# Altium schematic sheet Sheet1(final).SchDoc: ESP8266 Wifi Module
size A4
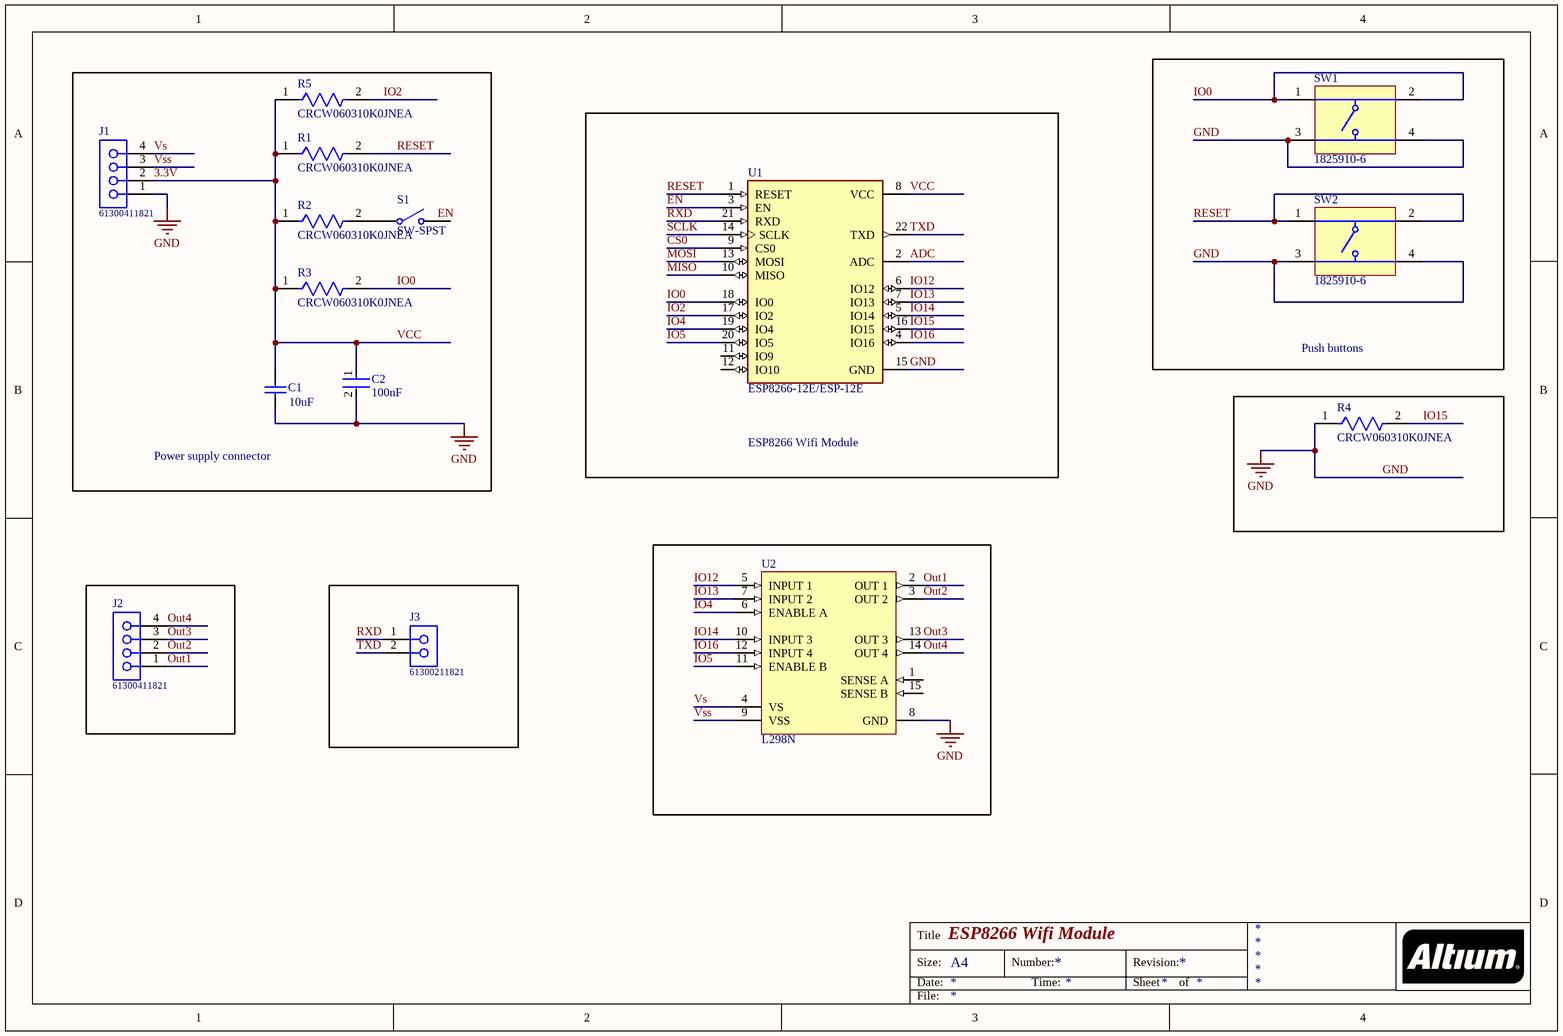
[diagram p0: Sheet1(final).SchDoc]

## Parts
C1  10uF  [CAPC2013X95X45ML10T25]
C2  100nF  [FP-CL43-IPC_B]
J1  61300411821  [61300411821]
J2  61300411821  [61300411821]
J3  61300211821  [61300211821]
R1  CRCW060310K0JNEA  [FP-CRCW0603-e3-MFG]
R2  CRCW060310K0JNEA  [FP-CRCW0603-e3-MFG]
R3  CRCW060310K0JNEA  [FP-CRCW0603-e3-MFG]
R4  CRCW060310K0JNEA  [FP-CRCW0603-e3-MFG]
R5  CRCW060310K0JNEA  [FP-CRCW0603-e3-MFG]
S1  SW-SPST  [SPST-2]
SW1  1825910-6  [TECO-1825910-6_V]
SW2  1825910-6  [TECO-1825910-6_V]
U1  ESP8266-12E/ESP-12E  [XCVR_ESP8266-12E/ESP-12E]
U2  L298N  [STM-FM-15]

## Blocks framed on the sheet
Power supply connector: C1 C2 J1 R1-R3 R5 S1
Push buttons: SW1 SW2
ESP8266 Wifi Module: U1

## Nets
GND: C1.1 C2.2 J1.1 R4.1 SW1.3 SW1.4 SW2.3 SW2.4 U1.15(GND) U2.8(GND)
3.3V: C1.2 C2.1 J1.2 R1.1 R2.1 R3.1 R5.1 U1.8(VCC)  [also labelled VCC]
ADC: U1.2(ADC)
CS0: U1.9(CS0)
EN: U1.3(EN)
IO0: R3.2 SW1.1 SW1.2 U1.18(IO0)
IO2: R5.2 U1.17(IO2)
IO4: U1.19(IO4) U2.6(ENABLE_A)
IO5: U1.20(IO5) U2.11(ENABLE_B)
IO12: U1.6(IO12) U2.5(INPUT_1)
IO13: U1.7(IO13) U2.7(INPUT_2)
IO14: U1.5(IO14) U2.10(INPUT_3)
IO15: R4.2 U1.16(IO15)
IO16: U1.4(IO16) U2.12(INPUT_4)
MISO: U1.10(MISO)
MOSI: U1.13(MOSI)
Out1: J2.1 U2.2(OUT_1)
Out2: J2.2 U2.3(OUT_2)
Out3: J2.3 U2.13(OUT_3)
Out4: J2.4 U2.14(OUT_4)
RESET: R1.2 SW2.1 SW2.2 U1.1(RESET)
RXD: J3.1 U1.21(RXD)
SCLK: U1.14(SCLK)
TXD: J3.2 U1.22(TXD)
Vs: J1.4 U2.4(VS)
Vss: J1.3 U2.9(VSS)
NetR2_2: R2.2 S1.1(COMMON)

Not connected (* = marked no-connect by the designer): S1 2(NO); U1 11(IO9) 12(IO10); U2 1(SENSE_A) 15(SENSE_B)

## Notes on the sheet
- Labels drawn without touching a wire or pin: EN
- Title
- Size:
- Date:
- A4
- Number:
- Time:
- Revision:
- Sheet
- of
- File:

## Library data of the parts
C1 = CMP-2007-00182-1: Manufacturer: Murata; Part Number: GRM219R61E106KA12D
C2 = CMP-13271-000927-1: Cap Ceramic 100nF 500V X7R ±10% SMD 1812 +125°C Embossed T/R; Mount: Surface Mount; Capacitance: 100nF; Voltage: 500V; Voltage Rating (DC): 500V; Voltage Rating: 500V; Length: 4.5mm; Height: 2mm; Case/Package: 1812; Radiation Hardening: No; Thickness: 0.087inch; Packaging: Tape and Reel; Package Quantity: 4000; Tolerance: 10%; Dielectric: X7R; Max Operating Temperature: 125°C; Width: 0.126inch; Min Operating Temperature: -55°C; Depth: 3.2mm
J1 J2 = 61300411821: WR-PHD Socket Header, THT, pitch 2.54mm, Single Row, Vertical, 4p; Manufacturer: Wurth Elektronik; Pin Number: 4; Rated Current: 3A; Working Voltage: 250VAC; Withstanding Voltage: 500VAC; Contact Resistance: 20mOhm; ComponentLink1Description: Manufacturer; ComponentLink1URL: http://www.we-online.de; ComponentLink2Description: Datasheet; ComponentLink2URL: https://www.we-online.com/catalog/datasheet/61300411821.pdf; Manufacturer Part Number: 61300411821; Published Date: May 2020; Pitch: 2.54mm; Operating Temperature: -40 to +125degC; Mounting Technology: THT; Packaging: Tray; Gender: Socket Header; Row Number: Single; Orientation: Vertical
J3 = 61300211821: WR-PHD Socket Header, THT, pitch 2.54mm, Single Row, Vertical, 2p; Manufacturer: Wurth Elektronik; Pin Number: 2; Rated Current: 3A; Working Voltage: 250VAC; Withstanding Voltage: 500VAC; Contact Resistance: 20mOhm; ComponentLink1Description: Manufacturer; ComponentLink1URL: http://www.we-online.de; ComponentLink2Description: Datasheet; ComponentLink2URL: https://www.we-online.com/catalog/datasheet/61300211821.pdf; Manufacturer Part Number: 61300211821; Published Date: May 2020; Pitch: 2.54mm; Operating Temperature: -40 to +125degC; Mounting Technology: THT; Packaging: Tray; Gender: Socket Header; Row Number: Single; Orientation: Vertical
R1-R5 = CMP-2000-03838-2: RES Thick Film, 10kΩ, 5%, 0.1W, 200ppm/°C, 0603; Max Power Dissipation: 100mW; Voltage Rating: 75V; Resistance: 10kR; Termination: SMD/SMT; Depth: 0.85mm; Weight: 7.1E-05oz; Military Standard: Not; Case Code (Imperial): 0603; Lead Free: Lead Free; Features: Automotive AEC-Q200; Tolerance: 5%; Case Code (Metric): 1608; Package Quantity: 1; Radiation Hardening: No; Number of Terminations: 2; Max Operating Temperature: 155°C; Min Operating Temperature: -55°C; Composition: Thick Film; Number of Pins: 2; Height: 0.02inch; Contact Plating: Tin; Temperature Coefficient: 200ppm/°C; Width: 0.033inch; Packaging: Tape and Reel; Length: 1.55mm; Mount: Surface Mount; Voltage Rating (DC): 75V; Case/Package: 0603; Power Rating: 100mW
S1 = SW-SPST: Single-Pole, Single-Throw Switch; Published: 24-Mar-1999; LatestRevisionDate: 17-Jul-2002; LatestRevisionNote: Re-released for DXP Platform.; PackageReference: SPST-2; Publisher: Altium Limited; PackageDescription: Switch; 2 Leads
SW1 SW2 = CMP-1684-00021-1: Tact Switch, SPST-NO, 0.05 A, -35 to 85 degC, 4-Pin THD, RoHS, Bulk; Manufacturer: TE Connectivity; Maximum Contact Resistance: 100mOhm; Mechanical Life: 100000Cycles; Bushing Type: Unthreaded; Switch Configuration: OFF(ON); Maximum DC Voltage Rating: 24V; Contact Rating @ Voltage: 0.05A@24VDC; Actuator Color: Black; Body Orientation: Straight; Function: MomentaryContact; Illumination: N/R; Actuator Style: RoundButton; Actuator Material: PolybutyleneTerephthalate; Dielectric Strength: 500VAC; Pole Throw Configuration: SPST; Actuator Length: 1.4mm; Product Weight: N/A; Contact Material: CopperAlloy; Housing Material: N/A; Terminal Type: PCPins; Minimum Insulation Resistance: 100MOhm; Package Description: 4-Pin Through Hole Device, Body 5.99 x 5.99 mm, Pitch 6.5 mm; Part No: 1825910-6; Package Reference: THD; Base Material: N/A; Manufacturer URL: http://www.te.com; Contact Plating: Silver; RoHS: Yes; Datasheet Version: Rev. C9; Electrical Life: 100000Cycles; Maximum AC Voltage Rating: N/A; Thread Size: N/R; Operating Temperature: -35to85C; Mounting: ThroughHole; Dimension: 5.99x5mm; Datasheet URL: http://www.te.com/commerce/DocumentDelivery/DDEController?Action=showdoc&DocId=Customer+Drawing%7F1825910%7FC9%7Fpdf%7FEnglish%7FENG_CD_1825910_C9.pdf%7F1825910-6; Family: 1825910; Seal Location: N/A; Seal Description: N/A; Packaging: N/A
U1 = ESP8266-12E/ESP-12E: This WiFi module has a 32-bit MCU micro and clock speeds supporting 80 MHz or 160 MHz. Supports the RTOS and integrated Wi-Fi MAC/BB/RF/PA/LNA, and has an on-board antenna.; MF: AI-Thinker; Price: None; Package: None; Value: *; MP: ESP8266-12E/ESP-12E; Availability: Unavailable; SnapEDA_Link: https://www.snapeda.com/parts/ESP8266-12E/ESP-12E/AI-Thinker/view-part/106414/?ref=snap
U2 = CMP-2000-06526-1: Dual Full-Bridge Driver, 4.8 to 46 V, -40 to 150 degC, 15-Pin FM (MW 15L), RoHS, Tube; Manufacturer: STMicroelectronics; PartNumber: L298; Output Current: 2A; Supply Voltage Max: 7V; Driver Case Style: Multiwatt; Supply Voltage Min: 4.5V; No. of Pins: 15Pins; SVHC: NoSVHC(17-Dec-2015); Output Voltage: 46V; No. of Outputs: 4Outputs; Motor Type: FullBridge; MSL: -; Package Description: 15-Pin Flange Mount, Body 5 x 19.6 mm, Pitch 1.27 mm; Datasheet Version: 01/2000; Package Reference: FM-15; Mounting Technology: ThroughHole; Packaging: Each; Automotive Qualification Standard: -; Product Range: -; Datasheet URL: https://datasheet.ciiva.com/15109/getdatasheetpartid-50682-15109332.pdf; Operating Temperature Max: 130°C; Operating Temperature Min: -25°C; Manufacturer URL: http://www.st.com/